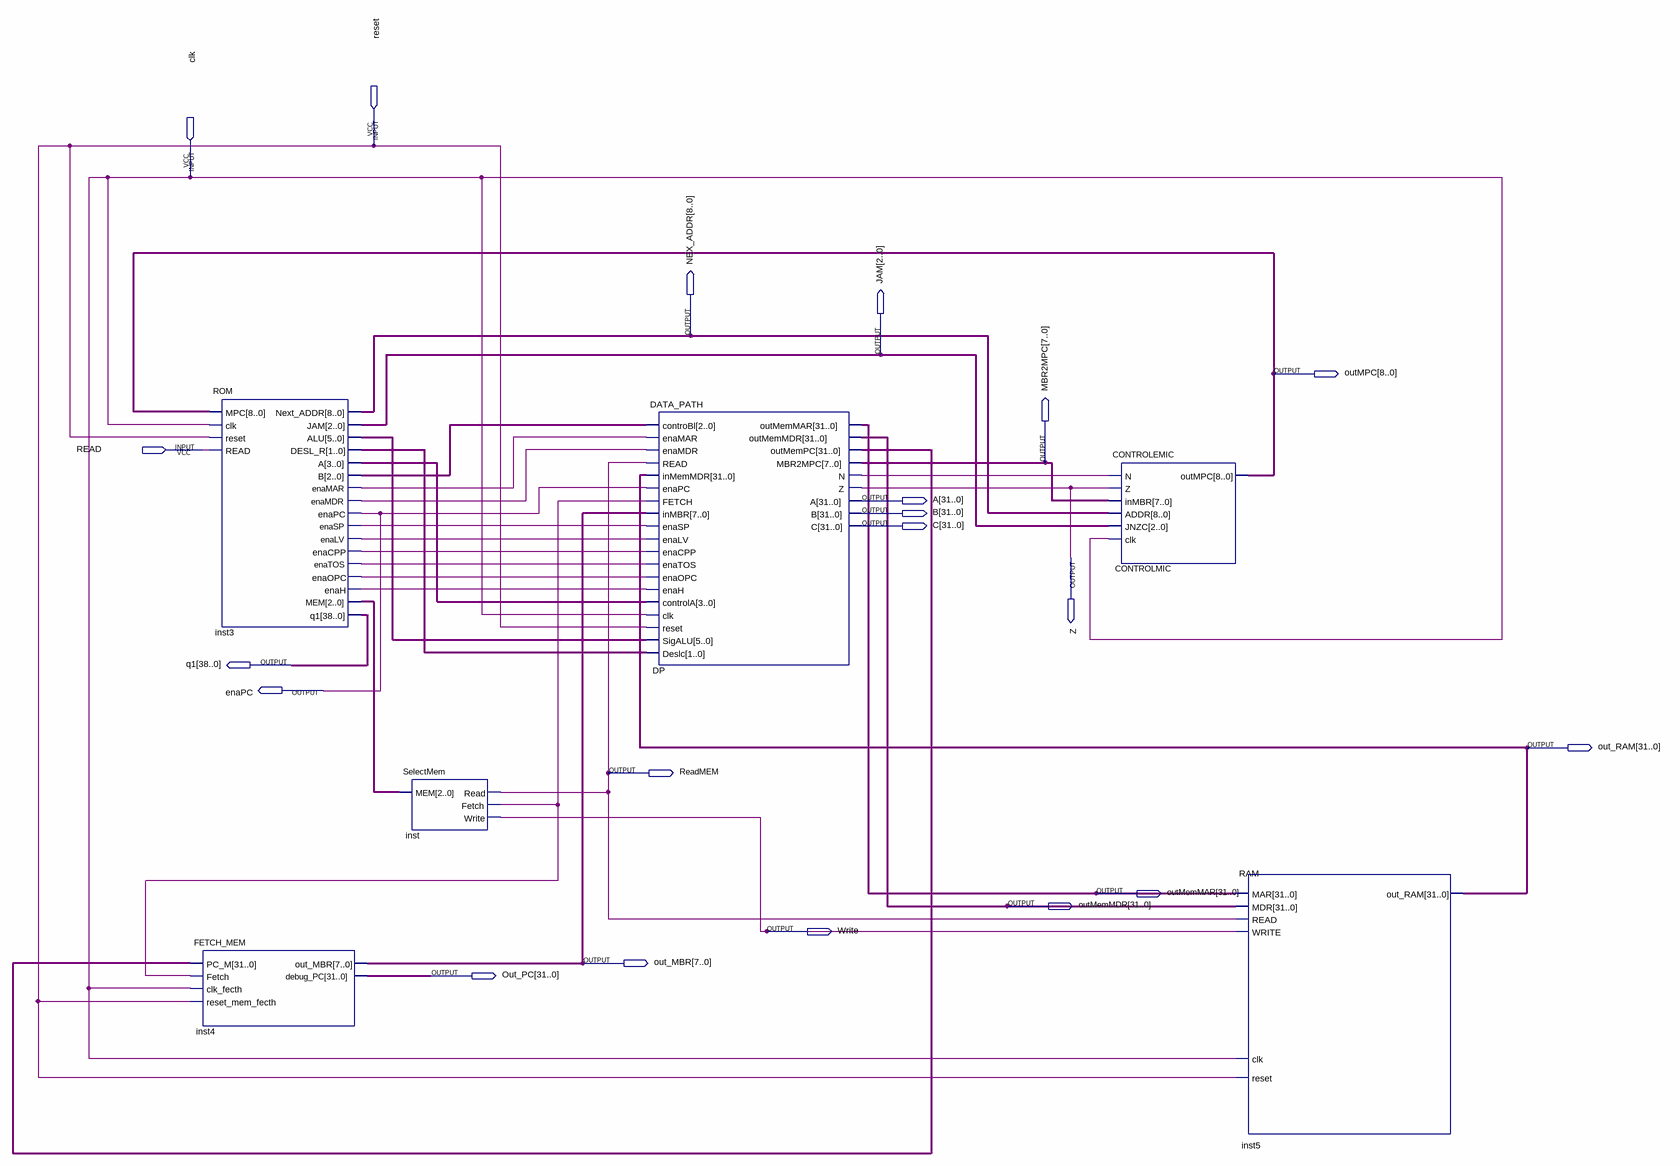
[diagram p0: schematic sheet]
// Quartus schematic MIC2.bdf as structural Verilog: 6 symbols, 20 pins
module MIC2 (
  input  reset,
  input  clk,
  input  READ,
  output [8:0] NEX_ADDR,
  output [2:0] JAM,
  output [8:0] outMPC,
  output [7:0] MBR2MPC,
  output [31:0] A,
  output [31:0] B,
  output [31:0] C,
  output Z,
  output [38:0] q1,
  output enaPC,
  output [31:0] out_RAM,
  output ReadMEM,
  output [31:0] outMemMAR,
  output [31:0] outMemMDR,
  output Write,
  output [7:0] out_MBR,
  output [31:0] Out_PC
);

  wire DP_n, inst3_enacpp, inst3_enah, inst3_enalv, inst3_enamar, inst3_enamdr, inst3_enaopc, inst3_enasp,
       inst3_enatos, inst_fetch;
  wire [1:0] inst3_desl_r;
  wire [2:0] inst3_b, inst3_mem;
  wire [3:0] inst3_a;
  wire [5:0] inst3_alu;
  wire [31:0] DP_outmempc;

  FETCH_MEM inst4 (
    .PC_M(DP_outmempc), .Fetch(inst_fetch), .clk_fecth(clk), .reset_mem_fecth(reset), .out_MBR(out_MBR),
    .debug_PC(Out_PC));
  ROM inst3 (
    .MPC(outMPC), .clk(clk), .reset(reset), .READ(READ), .Next_ADDR(NEX_ADDR), .JAM(JAM), .ALU(inst3_alu),
    .DESL_R(inst3_desl_r), .A(inst3_a), .B(inst3_b), .enaMAR(inst3_enamar), .enaMDR(inst3_enamdr),
    .enaPC(enaPC), .enaSP(inst3_enasp), .enaLV(inst3_enalv), .enaCPP(inst3_enacpp), .enaTOS(inst3_enatos),
    .enaOPC(inst3_enaopc), .enaH(inst3_enah), .MEM(inst3_mem), .q1(q1));
  SelectMem inst (.MEM(inst3_mem), .Read(ReadMEM), .Fetch(inst_fetch), .Write(Write));
  DATA_PATH DP (
    .controBl(inst3_b), .enaMAR(inst3_enamar), .enaMDR(inst3_enamdr), .READ(ReadMEM), .inMemMDR(out_RAM),
    .enaPC(enaPC), .FETCH(inst_fetch), .inMBR(out_MBR), .enaSP(inst3_enasp), .enaLV(inst3_enalv),
    .enaCPP(inst3_enacpp), .enaTOS(inst3_enatos), .enaOPC(inst3_enaopc), .enaH(inst3_enah),
    .controlA(inst3_a), .clk(clk), .reset(reset), .SigALU(inst3_alu), .Deslc(inst3_desl_r),
    .outMemPC(DP_outmempc), .MBR2MPC(MBR2MPC), .N(DP_n), .Z(Z), .A(A), .B(B), .C(C), .outMemMDR(outMemMDR),
    .outMemMAR(outMemMAR));
  CONTROLEMIC CONTROLMIC (.N(DP_n), .Z(Z), .inMBR(MBR2MPC), .ADDR(NEX_ADDR), .JNZC(JAM), .clk(clk), .outMPC(outMPC));
  RAM inst5 (
    .MAR(outMemMAR), .MDR(outMemMDR), .READ(ReadMEM), .WRITE(Write), .clk(clk), .reset(reset),
    .out_RAM(out_RAM));
endmodule
